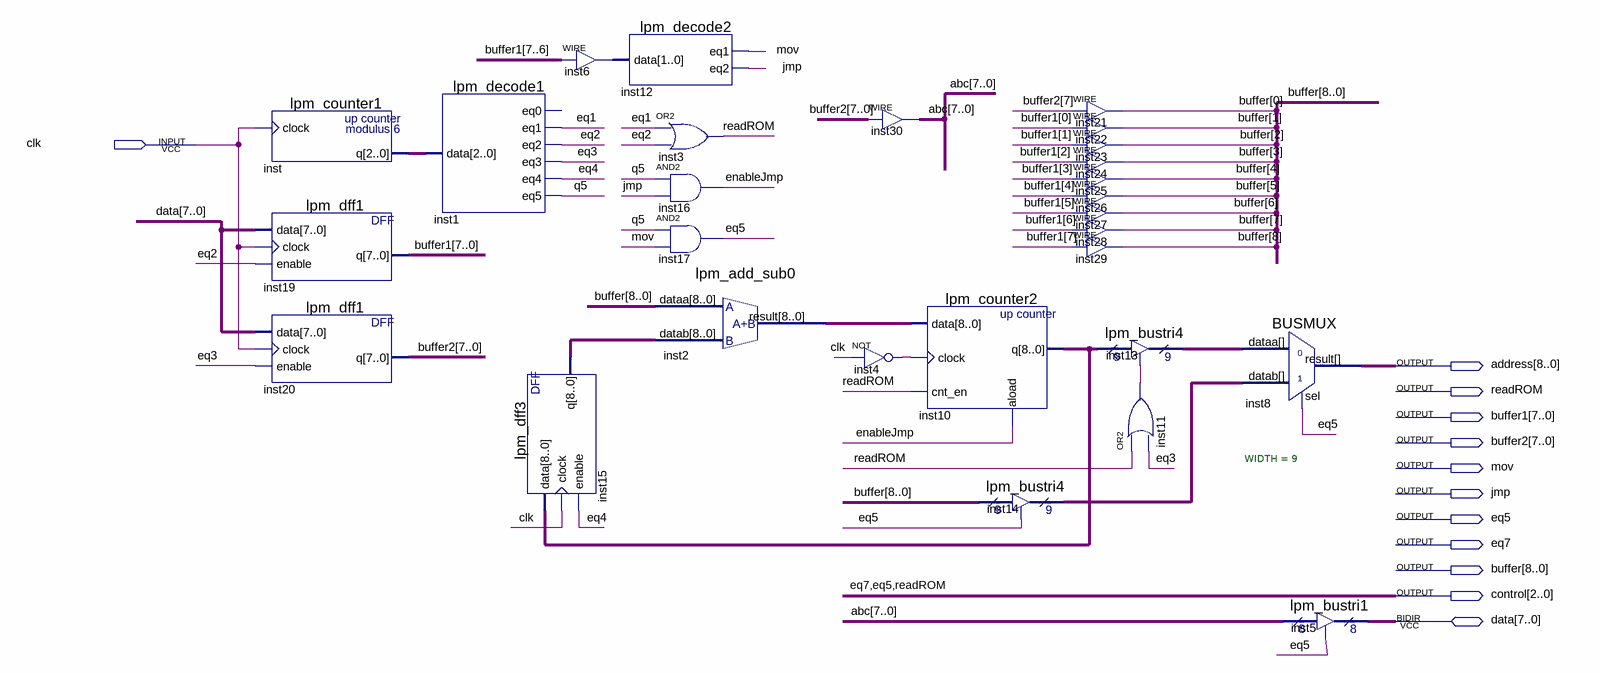
[diagram p0: schematic sheet]
// Quartus schematic CU.bdf as structural Verilog: 28 symbols, 12 pins
module CU (
  input  clk,
  inout  [7:0] data,
  output [8:0] address,
  output readROM,
  output [7:0] buffer1,
  output [7:0] buffer2,
  output mov,
  output jmp,
  output eq5,
  output eq7,
  output [8:0] buffer,
  output [2:0] control
);

  wire enableJmp, eq1, eq2, eq3, eq4, inst4_out, inst11_out, q5;
  wire [1:0] inst6_out;
  wire [2:0] inst_q;
  wire [7:0] abc;
  wire [8:0] inst2_result, inst10_q, inst13_tridata, inst14_tridata, inst15_q;

  lpm_counter1 inst (.clock(clk), .q(inst_q));
  lpm_dff1 inst19 (.data(data), .clock(clk), .enable(eq2), .q(buffer1));
  lpm_dff1 inst20 (.data(data), .clock(clk), .enable(eq3), .q(buffer2));
  lpm_decode1 inst1 (.data(inst_q), .eq1(eq1), .eq2(eq2), .eq3(eq3), .eq4(eq4), .eq5(q5));  // open: eq0
  assign inst6_out = buffer1[7:6];  // WIRE inst6
  lpm_dff3 inst15 (.data(inst10_q), .clock(clk), .enable(eq4), .q(inst15_q));
  lpm_decode2 inst12 (.data(inst6_out), .eq1(mov), .eq2(jmp));
  or inst3 (control[0], eq1, eq2);
  and inst16 (enableJmp, q5, jmp);
  and inst17 (control[1], q5, mov);
  lpm_add_sub0 inst2 (.dataa(buffer), .datab(inst15_q), .result(inst2_result));
  assign abc = buffer2;  // WIRE inst30
  not inst4 (inst4_out, clk);
  lpm_counter2 inst10 (.data(inst2_result), .clock(inst4_out), .cnt_en(control[0]), .aload(enableJmp), .q(inst10_q));
  lpm_bustri4 inst14 (.enabledt(control[1]), .data(buffer), .tridata(inst14_tridata));
  assign buffer[0] = buffer2[7];  // WIRE inst21
  assign buffer[1] = buffer1[0];  // WIRE inst22
  assign buffer[2] = buffer1[1];  // WIRE inst23
  assign buffer[3] = buffer1[2];  // WIRE inst24
  assign buffer[4] = buffer1[3];  // WIRE inst25
  assign buffer[5] = buffer1[4];  // WIRE inst26
  assign buffer[6] = buffer1[5];  // WIRE inst27
  assign buffer[7] = buffer1[6];  // WIRE inst28
  assign buffer[8] = buffer1[7];  // WIRE inst29
  lpm_bustri4 inst13 (.enabledt(inst11_out), .data(inst10_q), .tridata(inst13_tridata));
  or inst11 (inst11_out, control[0], eq3);
  BUSMUX #(.WIDTH(9)) inst8 (.datab(inst14_tridata), .sel(control[1]), .dataa(inst13_tridata), .result(address));
  lpm_bustri1 inst5 (.enabledt(control[1]), .data(abc), .tridata(data));

  assign eq5 = control[1];
  assign eq7 = control[2];
  assign readROM = control[0];
endmodule
